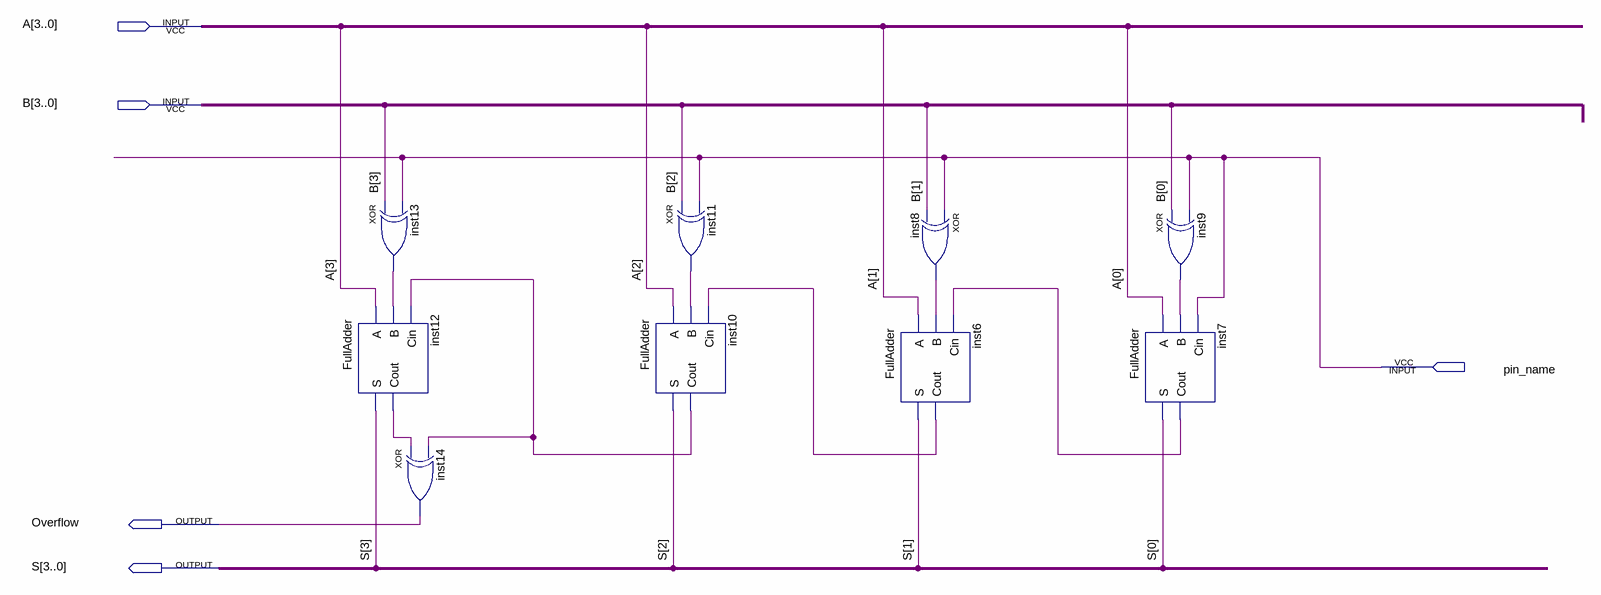
[diagram p0: schematic sheet]
// Quartus schematic Projeto Soma.bdf as structural Verilog: 9 symbols, 5 pins
module \Projeto_Soma  (
  input  [3:0] A,
  input  [3:0] B,
  input  pin_name,
  output Overflow,
  output [3:0] S
);

  wire inst6_cout, inst7_cout, inst8_out, inst9_out, inst10_cout, inst11_out, inst12_cout, inst13_out;

  FullAdder inst12 (.A(A[3]), .B(inst13_out), .Cin(inst10_cout), .S(S[3]), .Cout(inst12_cout));
  xor inst13 (inst13_out, B[3], pin_name);
  xor inst14 (Overflow, inst12_cout, inst10_cout);
  xor inst11 (inst11_out, B[2], pin_name);
  FullAdder inst10 (.A(A[2]), .B(inst11_out), .Cin(inst6_cout), .S(S[2]), .Cout(inst10_cout));
  xor inst8 (inst8_out, pin_name, B[1]);
  FullAdder inst6 (.A(A[1]), .B(inst8_out), .Cin(inst7_cout), .S(S[1]), .Cout(inst6_cout));
  xor inst9 (inst9_out, B[0], pin_name);
  FullAdder inst7 (.A(A[0]), .B(inst9_out), .Cin(pin_name), .S(S[0]), .Cout(inst7_cout));
endmodule
